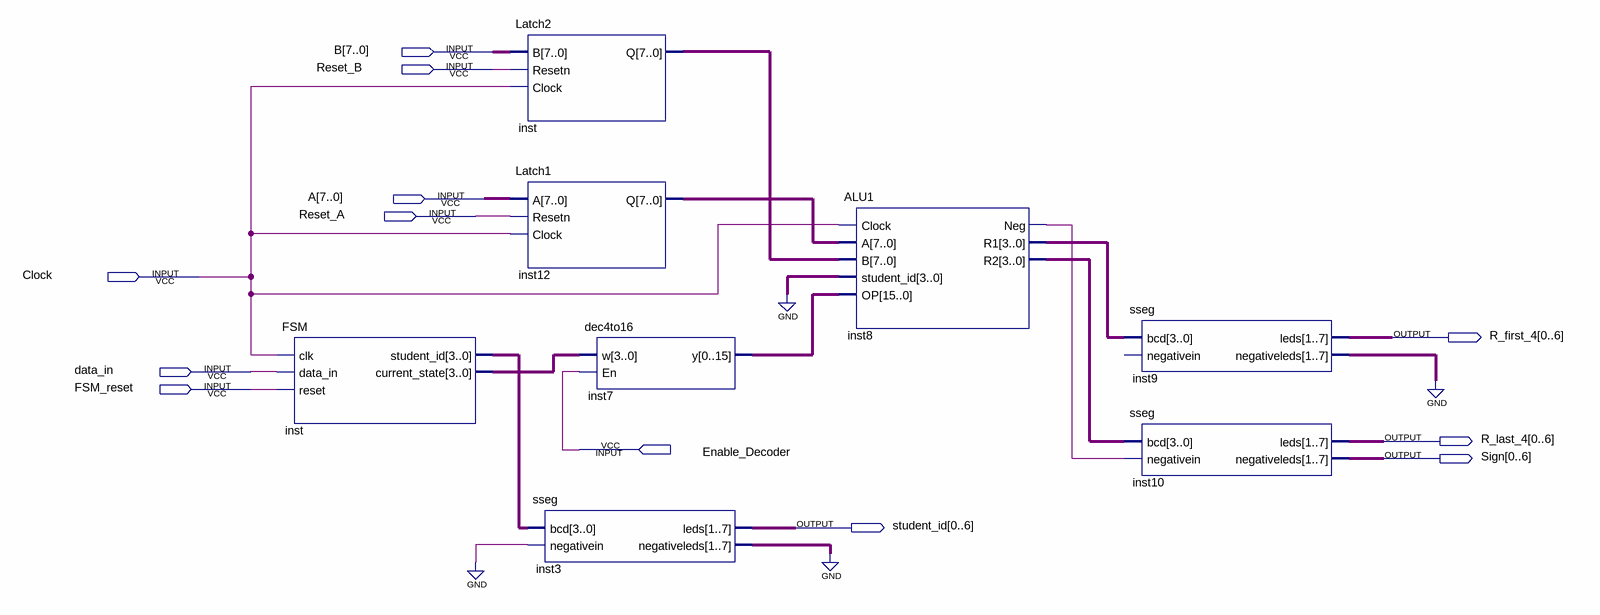
[diagram p0: schematic sheet]
// Quartus schematic test.bdf as structural Verilog: 8 symbols, 12 pins
module test (
  input  [7:0] B,
  input  Reset_B,
  input  [7:0] A,
  input  Reset_A,
  input  Clock,
  input  data_in,
  input  FSM_reset,
  input  Enable_Decoder,
  output [0:6] R_first_4,
  output [0:6] R_last_4,
  output [0:6] Sign,
  output [0:6] student_id
);

  wire inst8_neg;
  wire [3:0] inst8_r1, inst8_r2, inst_current_state, inst_student_id;
  wire [6:0] inst3_negativeleds, inst9_negativeleds;
  wire [7:0] inst12_q, inst_q;
  wire [15:0] inst7_y;

  FSM inst (
    .clk(Clock), .data_in(data_in), .reset(FSM_reset), .student_id(inst_student_id),
    .current_state(inst_current_state));
  Latch2 inst_dup2 (.B(B), .Resetn(Reset_B), .Clock(Clock), .Q(inst_q));
  Latch1 inst12 (.A(A), .Resetn(Reset_A), .Clock(Clock), .Q(inst12_q));
  sseg inst3 (.bcd(inst_student_id), .negativein(1'b0), .leds(student_id), .negativeleds(inst3_negativeleds));
  dec4to16 inst7 (.w(inst_current_state), .En(Enable_Decoder), .y(inst7_y));
  ALU1 inst8 (
    .Clock(Clock), .A(inst12_q), .B(inst_q), .student_id(4'b0000), .OP(inst7_y), .Neg(inst8_neg),
    .R1(inst8_r1), .R2(inst8_r2));
  sseg inst9 (.bcd(inst8_r1), .leds(R_first_4), .negativeleds(inst9_negativeleds));  // open: negativein
  sseg inst10 (.bcd(inst8_r2), .negativein(inst8_neg), .leds(R_last_4), .negativeleds(Sign));
  // also tied to GND on the sheet: {inst3_negativeleds[0], inst3_negativeleds[1], inst3_negativeleds[2], inst3_negativeleds[3], inst3_negativeleds[4], inst3_negativeleds[5], inst3_negativeleds[6], inst9_negativeleds[0], inst9_negativeleds[1], inst9_negativeleds[2], inst9_negativeleds[3], inst9_negativeleds[4], inst9_negativeleds[5], inst9_negativeleds[6]}
endmodule
